# EAGLE design TeamBot (EAGLE 4.03)
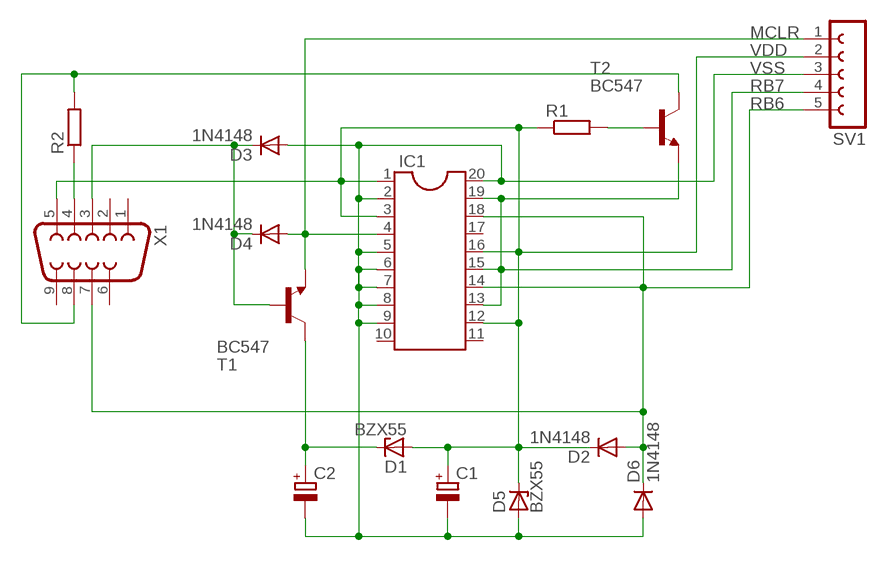
[diagram p0: schematic, sheet 1]

## Parts
C1  CPOL-EUE2.5-5  [E2,5-5]
C2  CPOL-EUE2.5-5  [E2,5-5]
D1  BZX55  [DO35Z10]
D2  1N4148  [DO35-10]
D3  1N4148  [DO35-10]
D4  1N4148  [DO35-10]
D5  BZX55  [DO35Z10]
D6  1N4148  [DO35-10]
IC1  DIL20  [DIL20]
R1  R-EU_0207/10  [0207/10]
R2  R-EU_0207/10  [0207/10]
SV1  FE05-1  [FE05-1]
T1  BC547  [TO92]
T2  BC547  [TO92]
X1  F09H  [F09H]

## Nets
MCLR: D4.A IC1.4 SV1.1 T1.1(E)
N$3: D3.C D4.C T1.2(B) X1.3
N$6: R1.2 T2.2(B)
N$7: R2.2 T2.3(C) X1.8
N$8: R2.1 X1.4
N$9: C2.+ D1.C T1.3(C)
RB6: D2.A D6.C IC1.14 IC1.18 SV1.5 X1.7
RB7: IC1.13 IC1.15 IC1.19 SV1.4 T2.1(E)
VDD: C1.+ D1.A D2.C D5.C IC1.1 IC1.3 IC1.12 IC1.16 R1.1 SV1.2 X1.5
VSS: C1.- C2.- D3.A D5.A D6.A IC1.2 IC1.5 IC1.6 IC1.7 IC1.8 IC1.9 IC1.20 SV1.3
Unconnected: IC1.10 IC1.11 IC1.17 X1.1 X1.2 X1.6 X1.9

## Library data of the parts
C1 C2 = rcl:CPOL-EU: POLARIZED CAPACITOR, European symbol
D1 D5 = diode:BZX55: Z DIODE
D2-D4 D6 = diode:1N4148: DIODE high speed (Philips)
IC1 = dil:DIL20: SOCKET DIL20
R1 R2 = rcl:R-EU_: RESISTOR, European symbol
SV1 = con-lsta:FE05-1: FEMALE HEADER
T1 T2 = transistor-npn:BC547: NPN TRANSISTOR
X1 = con-subd:F09H: HARTING SUB-D

## Board
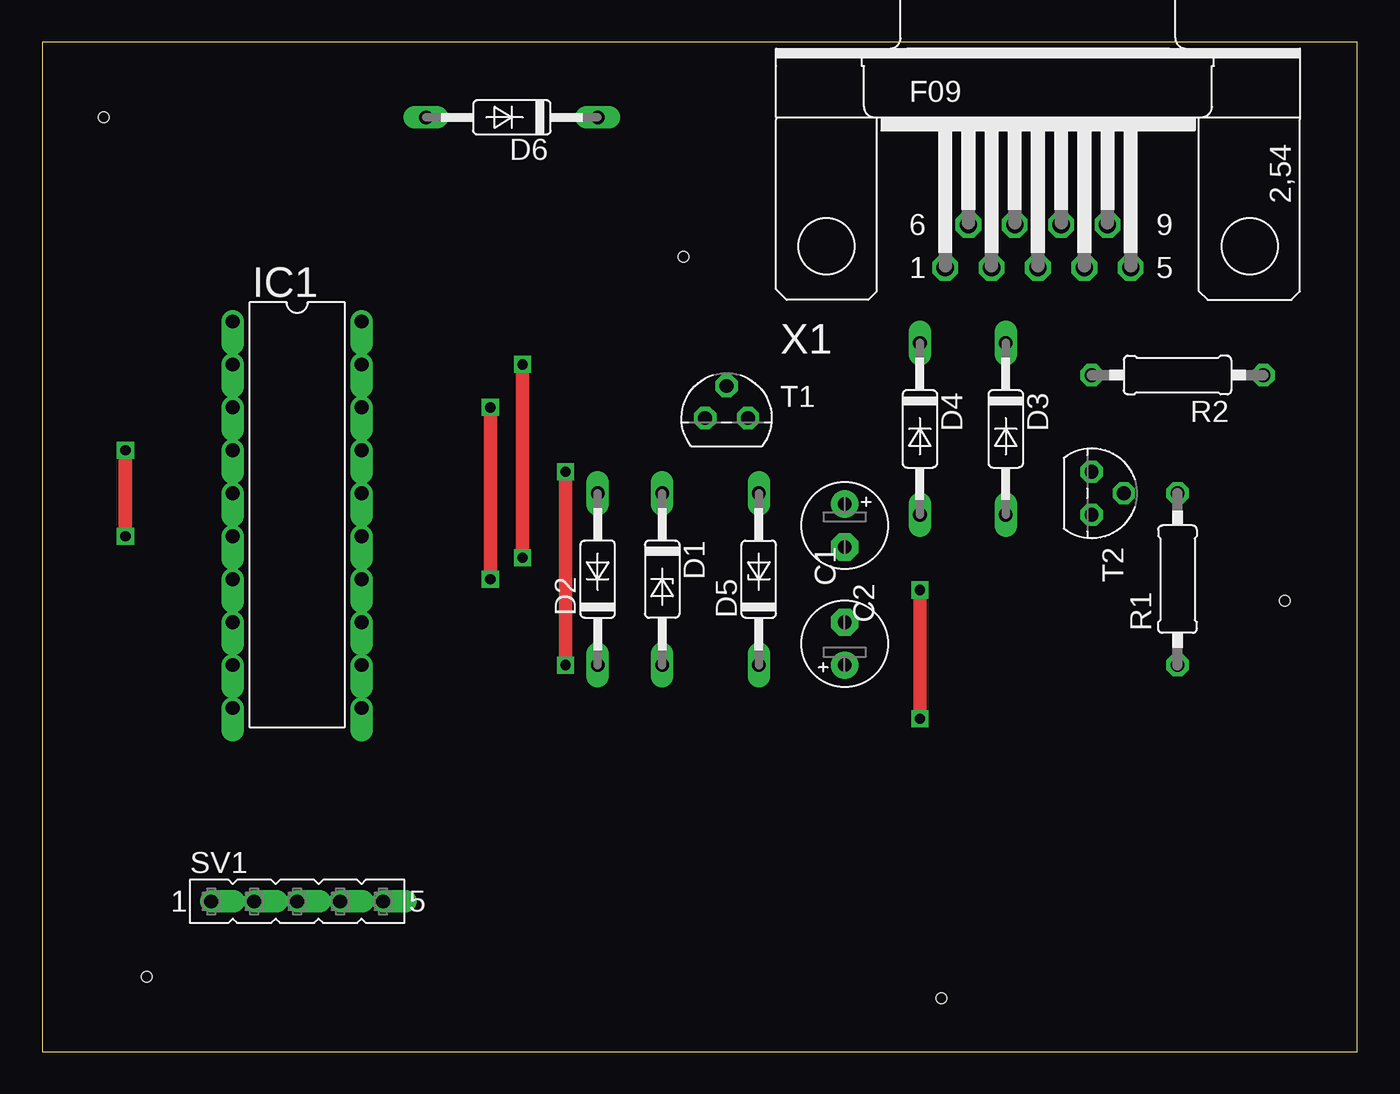
[diagram p1: board, top side]
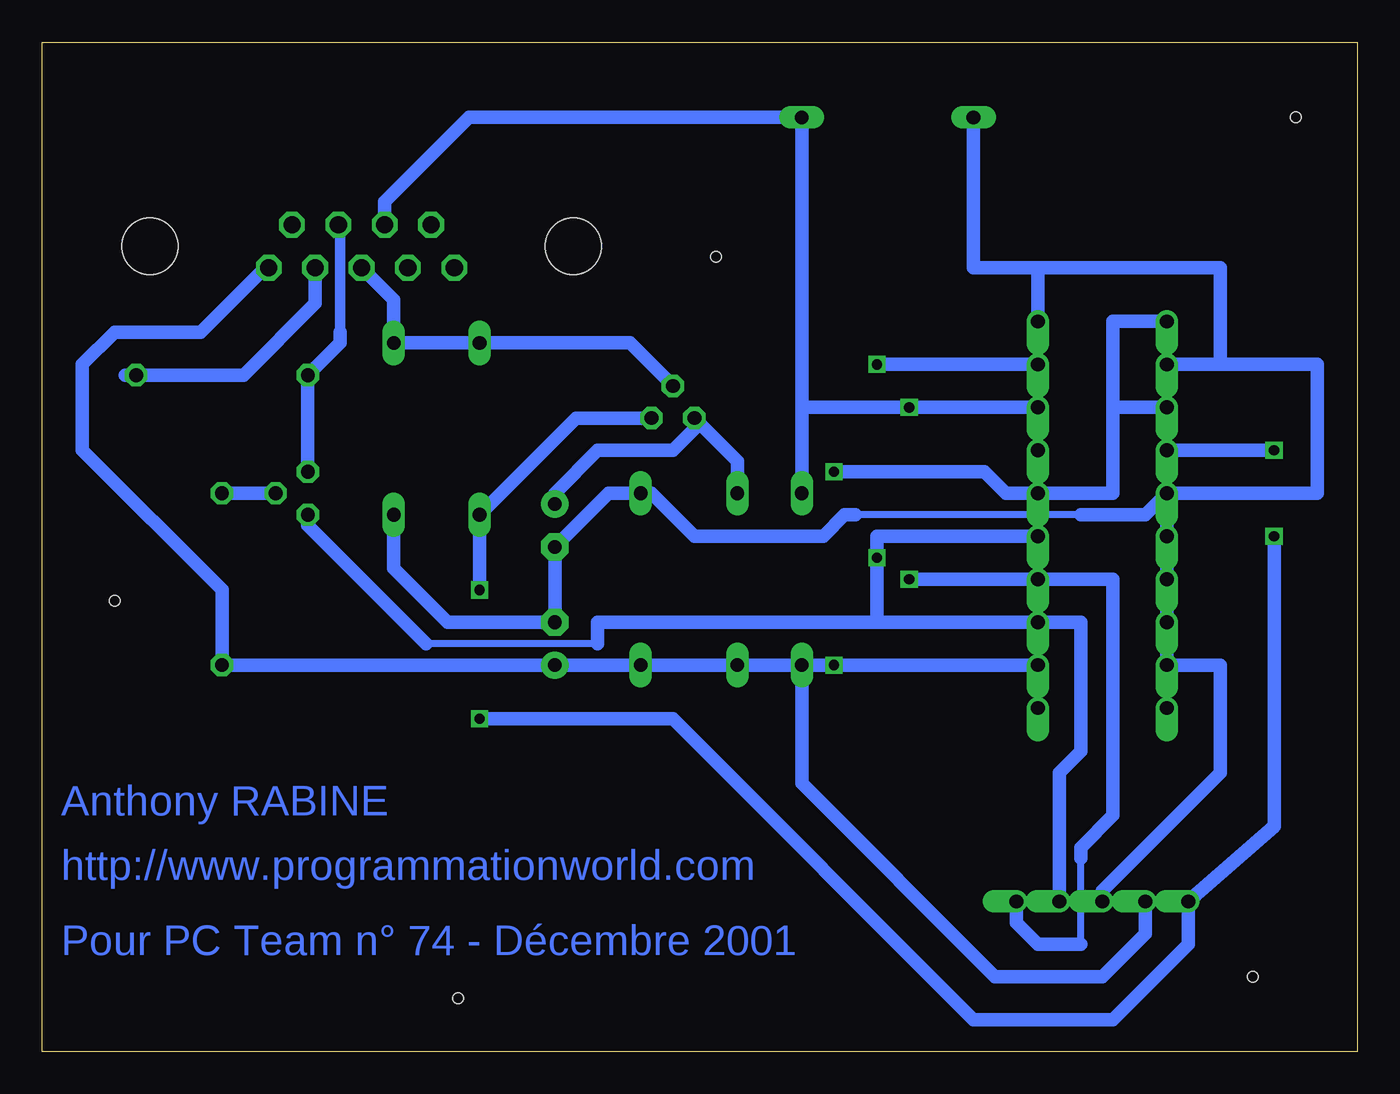
[diagram p2: board, bottom side, seen from below]

Size 77.77 x 59.68 mm. Coordinates in mm from the lower left corner, seen from the top.
Outline: 0,0 77.77,0 77.77,59.68 0,59.68 0,0
Copper layers used: Top, Bottom
Holes 0.61 mm at 3.65,55.24 6.19,4.44 53.18,3.17 73.49,26.66 37.94,46.98

### Footprints (pad centres in the part's own frame; a part is rotated, then mirrored left to right if it is on the bottom)
E2,5-5 = drill 0.813 pad 1.6 round: + -1.27,0 | drill 0.813 pad 1.6 octagon: - 1.27,0
DO35Z10 = drill 0.813 long: A 5.08,0; C -5.08,0
DO35-10 = drill 0.813 long: A 5.08,0; C -5.08,0
DIL20 = drill 0.813 offset: 1 -11.43,-3.81; 2 -8.89,-3.81; 3 -6.35,-3.81; 4 -3.81,-3.81; 5 -1.27,-3.81; 6 1.27,-3.81; 7 3.81,-3.81; 8 6.35,-3.81; 9 8.89,-3.81; 10 11.43,-3.81; 11 11.43,3.81; 12 8.89,3.81; 13 6.35,3.81; 14 3.81,3.81; 15 1.27,3.81; 16 -1.27,3.81; 17 -3.81,3.81; 18 -6.35,3.81; 19 -8.89,3.81; 20 -11.43,3.81
0207/10 = drill 0.813 octagon: 1 -5.08,0; 2 5.08,0
FE05-1 = drill 0.813 offset: 1 -5.08,0; 2 -2.54,0; 3 0,0; 4 2.54,0; 5 5.08,0
TO92 = drill 0.813 octagon: 1 1.27,0; 2 0,1.905; 3 -1.27,0
F09H = drill 1.016 octagon: 1 -5.486,-1.27; 2 -2.743,-1.27; 3 0,-1.27; 4 2.743,-1.27; 5 5.486,-1.27; 6 -4.115,1.27; 7 -1.372,1.27; 8 1.372,1.27; 9 4.115,1.27 | hole 3.302: -12.522,0; 12.522,0

### Placement (x,y rotation side)
C1  47.46,24.12 90 top
C2  47.46,31.11 270 top
D1  36.66,27.93 270 top
D2  32.85,27.93 90 top
D3  56.98,36.83 270 top
D4  51.91,36.83 270 top
D5  42.38,27.93 90 top
D6  27.77,55.24 180 top
IC1  15.08,31.75 270 top
R1  67.14,27.93 90 top
R2  67.14,40 180 top
SV1  15.08,8.88 0 top
T1  40.48,37.46 0 top
T2  62.07,33.02 270 top
X1  58.89,47.62 0 top

### Tracks (layer width: path | path; a pad name or v marks a point on that pad's centre or on a via)
MCLR  (via drill 0.61)
  Top 0.813: v51.91,19.68 v51.91,27.3 | v4.92,30.47 v4.92,35.55 v4.92,30.47
  Bottom 0.813: T1.1 46.19,37.46 D4.A v51.91,27.3 | v4.92,30.47 4.92,13.33 SV1.1 10,6.34 14.44,1.9 22.69,1.9 40.48,19.68 v51.91,19.68 | v4.92,35.55 IC1.4 v4.92,35.55
N$3
  Bottom 0.813: X1.3 56.98,44.45 D3.C D4.C 43.02,41.91 T1.2
N$6
  Bottom 0.813: T2.2 R1.2
N$7
  Bottom 0.61: X1.8 60.16,48.89 60.16,42.54
  Bottom 0.813: T2.3 R2.2 60.16,41.91 60.16,42.54
N$8
  Bottom 0.813: X1.4 61.63,44.24 65.88,40 R2.1 72.86,40
N$9
  Bottom 0.813: D1.C 36.66,34.92 T1.3 39.21,36.83 40.48,35.55 44.92,35.55 47.46,33.02 C2.+
RB6  (via drill 0.61)
  Top 0.813: v26.5,27.93 v26.5,38.09
  Bottom 0.406: 16.34,6.34 16.34,11.42
  Bottom 0.813: X1.7 57.52,50.26 52.54,55.24 D6.C D2.A 32.85,38.09 v26.5,38.09 IC1.18 | SV1.5 20.15,7.61 18.88,6.34 16.34,6.34 | 16.34,11.42 16.34,12.06 14.44,13.96 14.44,27.93 IC1.14 v26.5,27.93
RB7  (via drill 0.61)
  Top 0.813: v28.41,29.21 v28.41,40.64
  Bottom 0.406: 44.92,24.12 55.08,24.12
  Bottom 0.813: SV1.4 17.61,16.5 16.34,17.78 16.34,25.39 IC1.13 28.41,25.39 | 28.41,25.39 v28.41,29.21 28.41,30.47 | 28.41,30.47 IC1.15 | 28.41,25.39 28.41,30.47 | 55.08,24.12 62.07,31.11 T2.1 | 28.41,25.39 44.92,25.39 44.92,24.12 | v28.41,40.64 IC1.19 v28.41,40.64
VDD  (via drill 0.61)
  Top 0.813: v30.95,22.86 v30.95,34.28
  Bottom 0.813: D2.C D1.A | D1.A D5.C D1.A | D1.A C1.+ R1.1 67.14,27.3 75.4,35.55 75.4,40.64 73.49,42.54 68.41,42.54 64.61,46.35 X1.5 | IC1.1 14.44,43.17 14.44,38.09 | 14.44,38.09 IC1.3 | v30.95,22.86 30.31,22.86 | 14.44,38.09 14.44,33.02 IC1.16 20.79,33.02 22.06,34.28 v30.95,34.28 | SV1.2 12.54,6.98 15.08,4.44 21.42,4.44 32.85,15.87 D2.C | D2.C v30.95,22.86 | v30.95,22.86 IC1.12
VSS
  Bottom 0.406: 16.34,31.75 29.68,31.75
  Bottom 0.813: D3.A 56.98,28.57 53.81,25.39 C1.- C2.- 44.29,33.02 D5.A 41.75,33.02 39.21,30.47 31.58,30.47 30.31,31.75 29.68,31.75 | IC1.6 IC1.5 | IC1.6 IC1.5 | IC1.6 IC1.7 IC1.8 IC1.9 8.09,22.86 8.09,16.5 15.08,9.52 SV1.3 | 8.09,40.64 2.38,40.64 2.38,33.02 IC1.5 | 8.09,40.64 IC1.2 | 8.09,40.64 8.09,46.35 18.88,46.35 | 18.88,46.35 IC1.20 | 16.34,31.75 12.54,31.75 IC1.5 | 18.88,46.35 22.69,46.35 D6.A

### Text on the board
Bottom: Anthony RABINE | http://www.programmationworld.com | Pour PC Team n° 74 - Décembre 2001